# EAGLE design internal excitation 2 w gp v1.1 (EAGLE 6.5.0)
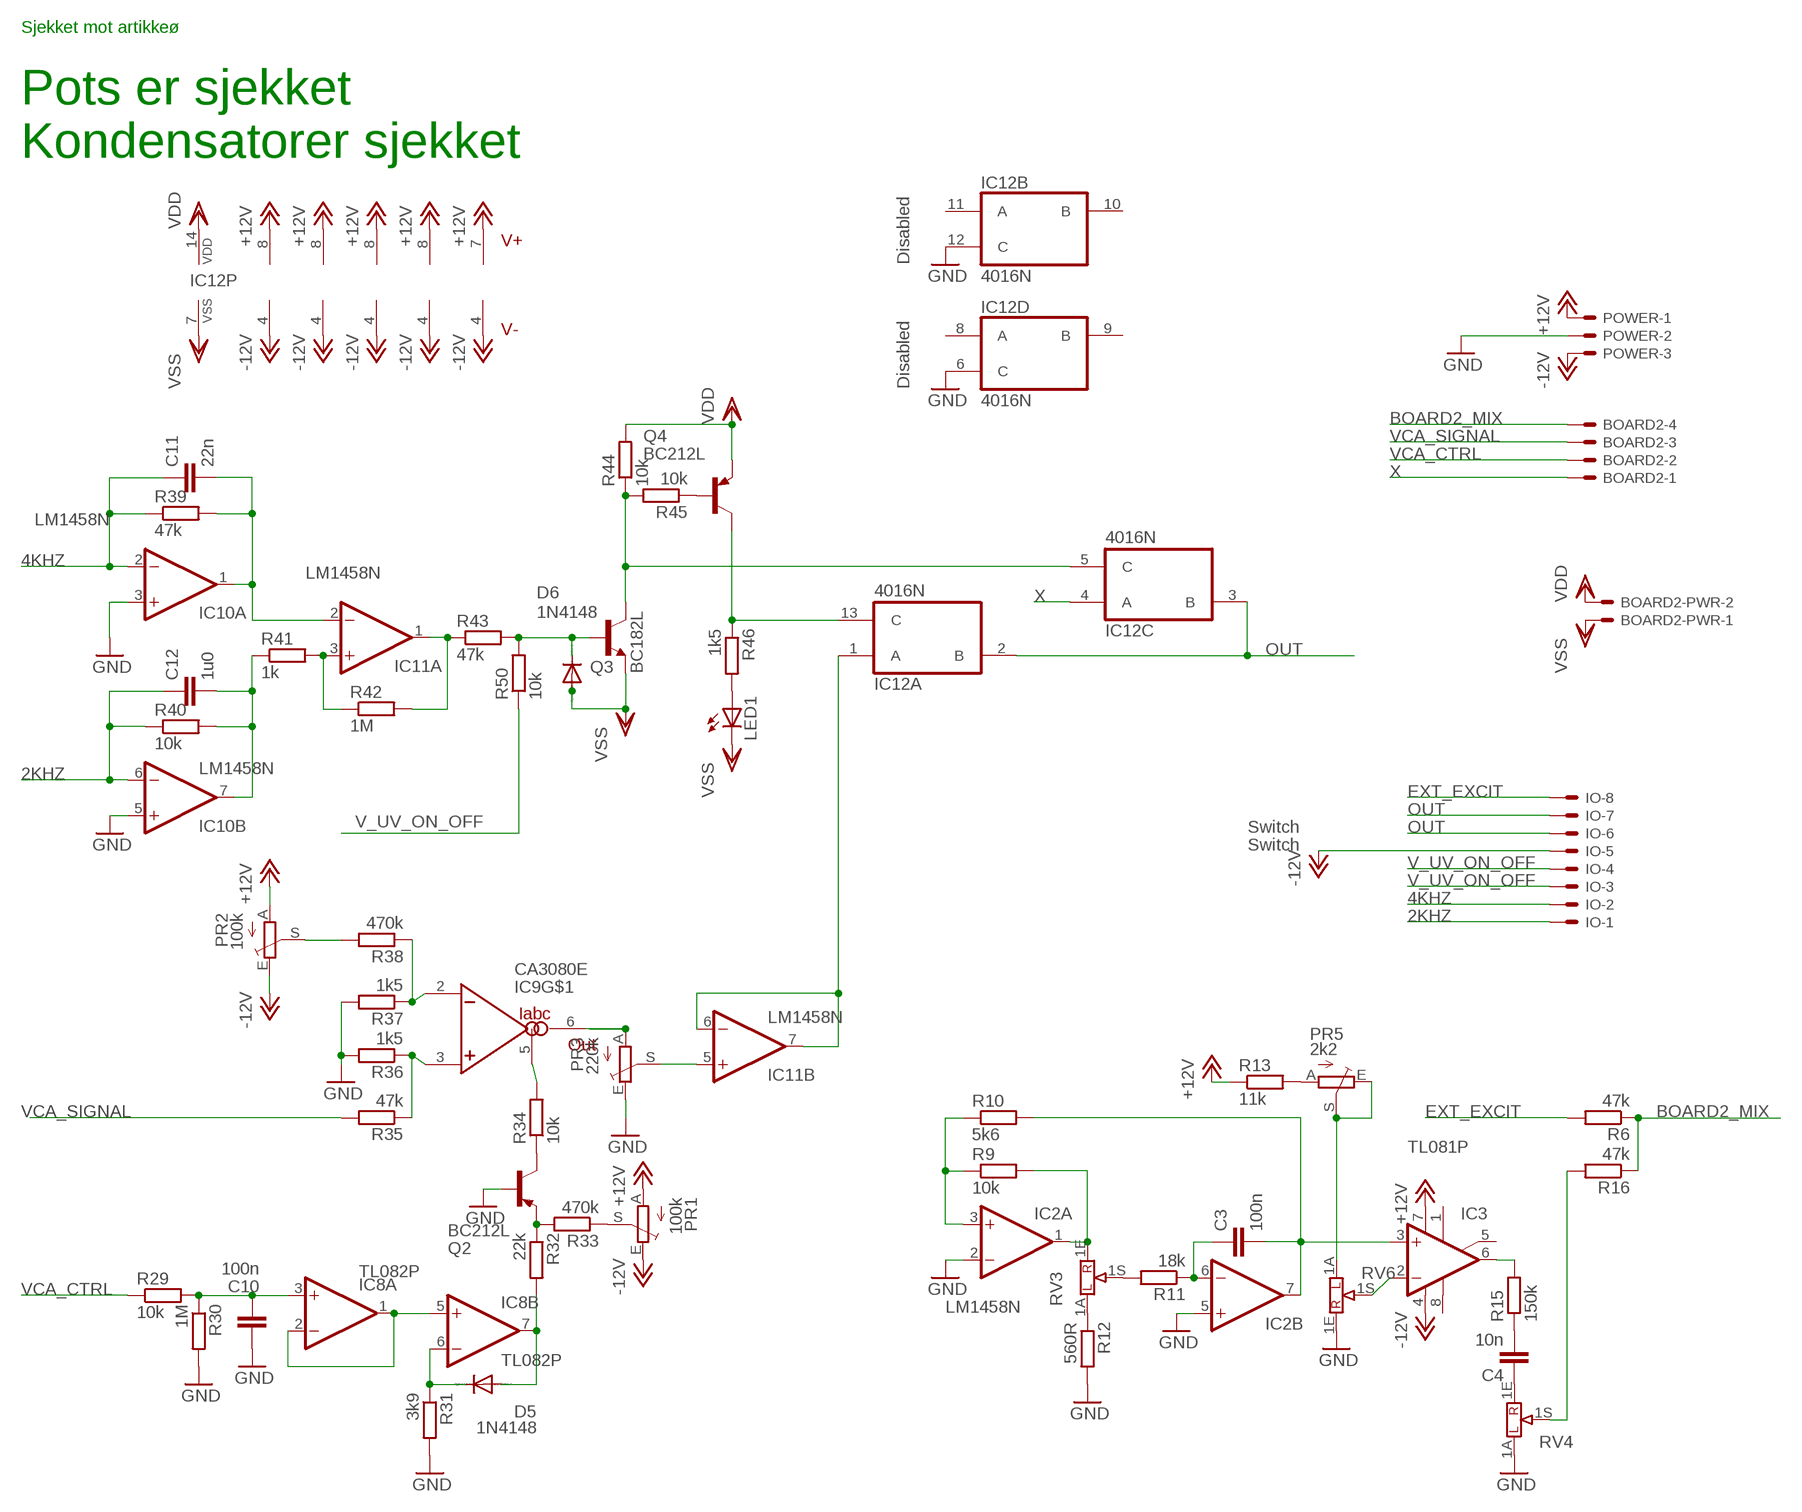
[diagram p0: schematic, sheet 1]

## Parts
BOARD2  22-23-2041  [22-23-2041]
BOARD2-PWR  22-23-2021  [22-23-2021]
C3  100n  C-EU050-030X075  [C050-030X075]
C4  10n  C-EU025-025X050  [C025-025X050]
C10  100n  C-EU050-030X075  [C050-030X075]
C11  22n  C-EU050-030X075  [C050-030X075]
C12  1u0  C-EU050-030X075  [C050-030X075]
D5  1N4148  1N4148DOJ35-5  [DO35-5J]
D6  1N4148  1N4148DOJ35-5  [DO35-5J]
IC2  LM1458N  [DIL08]
IC3  TL081P  [DIL08]
IC8  TL082P  [DIL08]
IC9  CA3080E  [DIL08]
IC10  LM1458N  [DIL08]
IC11  LM1458N  [DIL08]
IC12  4016N  [DIL14]
IO  22-23-2081  [22-23-2081]
LED1  LED3MM  [LED3MM]
POWER  KK-156-3  [KK-156-3]
PR1  100k  TRIM_EU-CA9V  [CA9V]
PR2  100k  TRIM_EU-CA9V  [CA9V]
PR3  220k  TRIM_EU-CA9V  [CA9V]
PR5  2k2  TRIM_EU-CA9V  [CA9V]
Q2  BC212L  BF493S-PNP-TO92-CBE  [TO92-CBE]
Q3  BC182L  -NPN-TO92-ECB  [TO92-ECB]
Q4  BC212L  BF493S-PNP-TO92-CBE  [TO92-CBE]
R6  47k  R-EU_0207/10  [0207/10]
R9  10k  R-EU_0207/7  [0207/7]
R10  5k6  R-EU_0207/7  [0207/7]
R11  18k  R-EU_0207/7  [0207/7]
R12  560R  R-EU_0207/7  [0207/7]
R13  11k  R-EU_0207/7  [0207/7]
R15  150k  R-EU_0207/7  [0207/7]
R16  47k  R-EU_0207/7  [0207/7]
R29  10k  R-EU_0207/7  [0207/7]
R30  1M  R-EU_0207/7  [0207/7]
R31  3k9  R-EU_0207/7  [0207/7]
R32  22k  R-EU_0207/7  [0207/7]
R33  470k  R-EU_0207/7  [0207/7]
R34  10k  R-EU_0207/7  [0207/7]
R35  47k  R-EU_0207/7  [0207/7]
R36  1k5  R-EU_0207/7  [0207/7]
R37  1k5  R-EU_0207/7  [0207/7]
R38  470k  R-EU_0207/7  [0207/7]
R39  47k  R-EU_0207/7  [0207/7]
R40  10k  R-EU_0207/7  [0207/7]
R41  1k  R-EU_0207/7  [0207/7]
R42  1M  R-EU_0207/7  [0207/7]
R43  47k  R-EU_0207/7  [0207/7]
R44  10k  R-EU_0207/7  [0207/7]
R45  10k  R-EU_0207/7  [0207/7]
R46  1k5  R-EU_0207/7  [0207/7]
R50  10k  R-EU_0207/7  [0207/7]
RV3  10k log  POT16_W_BRACKET""  [POT16_W_BRACKET]
RV4  10k log  POT16_W_BRACKET""  [POT16_W_BRACKET]
RV6  10k  POT16_W_BRACKET""  [POT16_W_BRACKET]

## Nets
2KHZ: C12.1 IC10.6(B:-IN) IO.1 R40.1
4KHZ: C11.1 IC10.2(A:-IN) IO.2 R39.1
+12V: IC2.8(P:V+) IC3.7(V+) IC8.8(P:V+) IC9.7(V+) IC10.8(P:V+) IC11.8(P:V+) POWER.1 PR1.A PR2.A R13.1
-12V: IC2.4(P:V-) IC3.4(V-) IC8.4(P:V-) IC9.4(V-) IC10.4(P:V-) IC11.4(P:V-) IO.5 POWER.3 PR1.E PR2.E
BOARD2_MIX: BOARD2.4 R6.1 R16.1
EXT_EXCIT: IO.8 R6.2
GND: C10.1 IC2.2(A:-IN) IC2.5(B:+IN) IC10.3(A:+IN) IC10.5(B:+IN) IC12.6(D:C) IC12.12(B:C) POWER.2 PR3.E Q2.B R12.2 R30.2 R31.2 R36.2 R37.2 RV4.1A RV6.1E
N$1: IC2.3(A:+IN) R9.1 R10.1
N$2: IC2.1(A:OUT) R9.2 RV3.1E
N$3: R11.2 RV3.1S
N$4: C3.1 IC2.6(B:-IN) R11.1
N$5: R12.1 RV3.1A
N$6: C3.2 IC2.7(B:OUT) IC3.3(+IN) R10.2
N$7: IC3.2(-IN) RV6.1S
N$8: PR5.A R13.2
N$9: PR5.E PR5.S RV6.1A
N$10: IC3.6(OUT) R15.2
N$11: C4.2 R15.1
N$12: C4.1 RV4.1E
N$13: R16.2 RV4.1S
N$14: IC11.3(A:+IN) R41.2 R42.1
N$15: C11.2 IC10.1(A:OUT) IC11.2(A:-IN) R39.2
N$16: IC11.1(A:OUT) R42.2 R43.1
N$17: C12.2 IC10.7(B:OUT) R40.2 R41.1
N$18: LED1.A R46.2
N$19: IC12.5(C:C) Q3.C R44.1 R45.2
N$20: Q4.B R45.1
N$21: D6.C Q3.B R43.2 R50.2
N$22: IC9.6(OUT) PR3.A
N$23: IC12.13(A:C) Q4.C R46.1
N$24: Q2.C R34.1
N$25: IC9.3(+IN) R35.1 R36.1
N$26: IC9.2(-IN) R37.1 R38.1
N$27: PR2.S R38.2
N$28: IC9.5(IABC) R34.2
N$30: Q2.E R32.1 R33.2
N$31: PR1.S R33.1
N$34: IC11.5(B:+IN) PR3.S
N$35: IC11.6(B:-IN) IC11.7(B:OUT) IC12.1(A:A)
N$37: D5.A IC8.7(B:OUT) R32.2
N$38: IC8.1(A:OUT) IC8.2(A:-IN) IC8.5(B:+IN)
N$41: D5.C IC8.6(B:-IN) R31.1
N$42: C10.2 IC8.3(A:+IN) R29.2 R30.1
OUT: IC12.2(A:B) IC12.3(C:B) IO.6 IO.7
V_UV_ON_OFF: IO.3 IO.4 R50.1
VCA_CTRL: BOARD2.2 R29.1
VCA_SIGNAL: BOARD2.3 R35.2
VDD: BOARD2-PWR.2 IC12.14(P:VDD) Q4.E R44.2
VSS: BOARD2-PWR.1 D6.A IC12.7(P:VSS) LED1.K(C) Q3.E
X: BOARD2.1 IC12.4(C:A)
Unconnected: IC3.1(ON1) IC3.5(ON2) IC3.8(OPT) IC12.8(D:A) IC12.9(D:B) IC12.10(B:B) IC12.11(B:A) RV3.M1 RV3.M2 RV3.M3 RV3.M4 RV4.M1 RV4.M2 RV4.M3 RV4.M4 RV6.M1 RV6.M2 RV6.M3 RV6.M4

## Notes on the sheet
- Sjekket mot artikkeø
- Pots er sjekket
- Kondensatorer sjekket
- Disabled
- Disabled
- Switch
- Switch

## Library data of the parts
BOARD2 = con-molex:22-23-2041: .100" (2.54mm) Center Header - 4 Pin; MF: MOLEX; MPN: 22-23-2041; OC_FARNELL: 1462920; OC_NEWARK: 38C0355
BOARD2-PWR = con-molex:22-23-2021: .100" (2.54mm) Center Header - 2 Pin; MF: MOLEX; MPN: 22-23-2021; OC_FARNELL: 1462926; OC_NEWARK: 25C3832
C3 C4 C10-C12 = resistor:C-EU: CAPACITOR, European symbol
D5 D6 = joakim:1N4148: DIODE high speed (Philips)
IC2 IC10 IC11 = linear:*1458: OP AMP
IC3 = linear:TL081: OP AMP
IC8 = linear:TL082: OP AMP
IC9 = joakim:CA3080: Original RCA OTA.
IC12 = 40xx:4016: Quad bilateral ANALOG SWITCH
IO = con-molex:22-23-2081: .100" (2.54mm) Center Header - 8 Pin; MF: MOLEX; MPN: 22-23-2081; OC_FARNELL: 1756826; OC_NEWARK: 01C7592
LED1 = led:LED: LED OSRAM: - CHIPLED LG R971, LG N971, LY N971, LG Q971, LY Q971, LO R971, LY R971 LH N974, LH R974 LS Q976, LO Q976, LY Q976 LO Q996 - Hyper CHIPLED LW Q18S LB Q993, LB Q99A, LB R99A - SideLED LS A670, LO A670, LY A670, LG A670, LP A670 LB A673, LV A673, LT A673, LW A673 LH A674 LY A675 LS A676, LA A676, LO A676, LY A676, LW A676 LS A679, LY A679, LG A679 - Hyper Micro SIDELED® LS Y876, LA Y876, LO Y876, LY Y876 LT Y87S - SmartLED LW L88C, LW L88S LB L89C, LB L89S, LG L890 LS L89K, LO L89K, LY L89K LS L896, LA L896, LO L896, LY L896 - TOPLED LS T670, LO T670, LY T670, LG T670, LP T670 LSG T670, LSP T670, LSY T670, LOP T670, LYG T670 LG T671, LOG T671, LSG T671 LB T673, LV T673, LT T673, LW T673 LH T674 LS T676, LA T676, LO T676, LY T676, LB T676, LH T676, LSB T676, LW T676 LB T67C, LV T67C, LT T67C, LS T67K, LO T67K, LY T67K, LW E67C LS E67B, LA E67B, LO E67B, LY E67B, LB E67C, LV E67C, LT E67C LW T67C LS T679, LY T679, LG T679 LS T770, LO T770, LY T770, LG T770, LP T770 LB T773, LV T773, LT T773, LW T773 LH T774 LS E675, LA E675, LY E675, LS T675 LS T776, LA T776, LO T776, LY T776, LB T776 LHGB T686 LT T68C, LB T68C - Hyper Mini TOPLED® LB M676 - Mini TOPLED Santana® LG M470 LS M47K, LO M47K, LY M47K Source: http://www.osram.convergy.de LUXEON: - LUMILED® LXK2-PW12-R00, LXK2-PW12-S00, LXK2-PW14-U00, LXK2-PW14-V00 LXK2-PM12-R00, LXK2-PM12-S00, LXK2-PM14-U00 LXK2-PE12-Q00, LXK2-PE12-R00, LXK2-PE12-S00, LXK2-PE14-T00, LXK2-PE14-U00 LXK2-PB12-K00, LXK2-PB12-L00, LXK2-PB12-M00, LXK2-PB14-N00, LXK2-PB14-P00, LXK2-PB14-Q00 LXK2-PR12-L00, LXK2-PR12-M00, LXK2-PR14-Q00, LXK2-PR14-R00 LXK2-PD12-Q00, LXK2-PD12-R00, LXK2-PD12-S00 LXK2-PH12-R00, LXK2-PH12-S00 LXK2-PL12-P00, LXK2-PL12-Q00, LXK2-PL12-R00 Source: www.luxeon.com KINGBRIGHT: KA-3528ASYC Source: www.kingbright.com
POWER = con-molex:KK-156-3: KK 156 HEADER Source: http://www.molex.com/pdm_docs/sd/026604100_sd.pdf; OC_FARNELL: unknown; OC_NEWARK: unknown
PR1-PR3 PR5 = pot:TRIM_EU-: POTENTIOMETER
Q2 Q4 = transistor:*-PNP-: PNP Transistror
Q3 = transistor:*-NPN-: NPN Transistror BF959 corrected 2008.03.06
R6 R9-R13 R15 R16 R29-R46 R50 = resistor:R-EU_: RESISTOR, European symbol
RV3 RV4 RV6 = joakim:POT16_W_BRACKET: POTENTIOMETER potentiometer, 16 mm w 5mm pitch and OMEG bracket, 17,8 x 7,5 mm

## Board
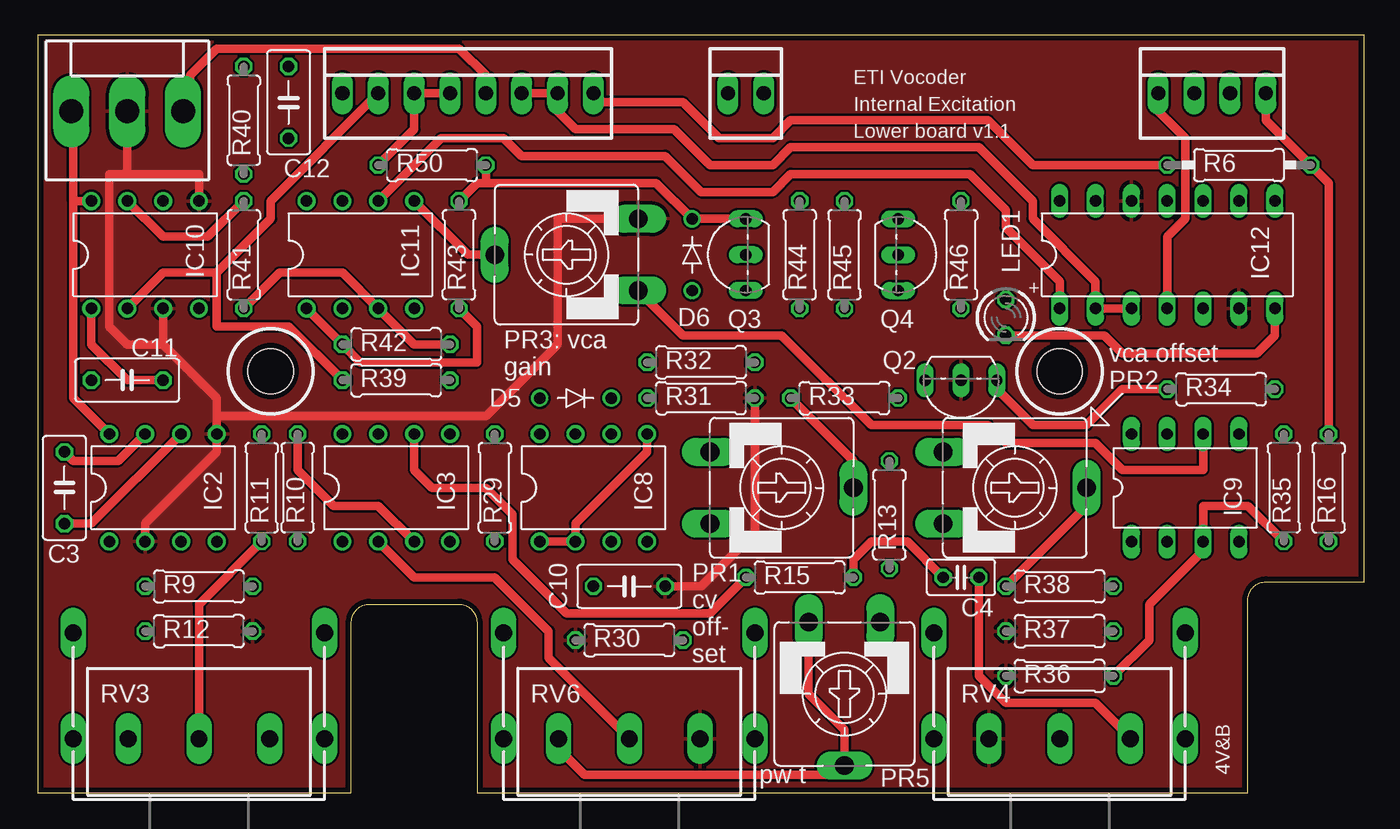
[diagram p1: board, top side]
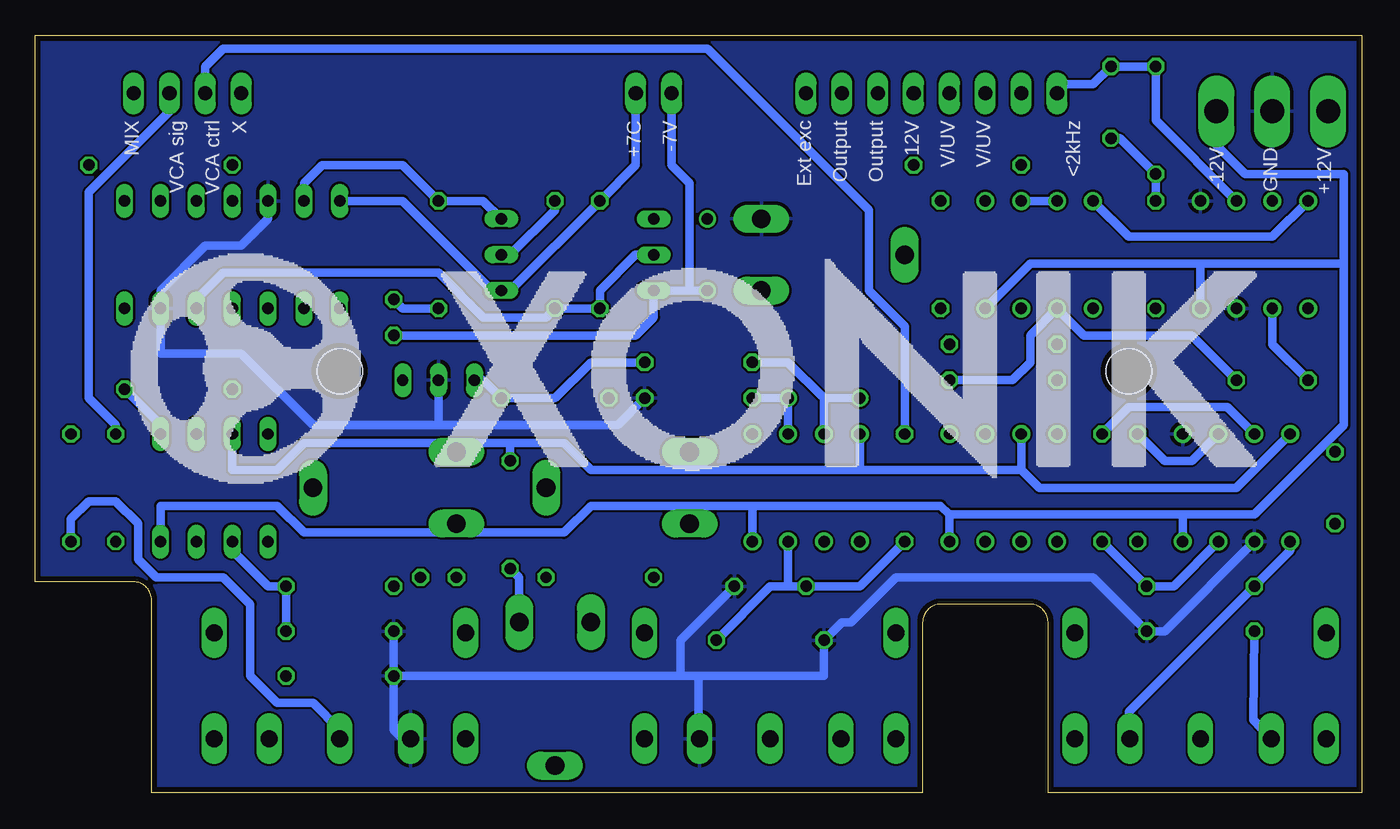
[diagram p2: board, bottom side, seen from below]

Size 93.96 x 53.65 mm. Coordinates in mm from the lower left corner, seen from the top.
Outline: 0,0 22.23,0 22.23,12.06 arc-90 23.5,13.34 29.84,13.34 arc-90 31.11,12.06 31.11,0 85.72,0 85.72,13.65 arc-90 87,14.92 93.96,14.92 93.96,53.65 0,53.65 0,0
Copper layers (1*16): Top 0.0356mm / dielectric 1.5011mm / Bottom 0.0356mm
Design rules "default": minimum track width 6mil, minimum drill 13mil, track to track 6mil, track to pad 6mil, pad to pad 6mil, via to via 6mil, smd to smd 6mil, copper to edge 15mil, drill to drill 6mil, minimum pad ring 7mil, minimum via ring 7mil, stop-mask expansion 3mil, vias tented up to drill 0mil, thermal gap 10mil
Holes 3.2 mm at 16.51,29.84 72.39,29.84

### Footprints (pad centres in the part's own frame; a part is rotated, then mirrored left to right if it is on the bottom)
22-23-2041 = drill 1 long: 1 -3.81,0; 2 -1.27,0; 3 1.27,0; 4 3.81,0
22-23-2021 = drill 1 long: 1 -1.27,0; 2 1.27,0
C050-030X075 = drill 0.813 octagon: 1 -2.54,0; 2 2.54,0
C025-025X050 = drill 0.813 octagon: 1 -1.27,0; 2 1.27,0
DO35-5J = drill 0.813: A 2.54,0; C -2.54,0
DIL08 = drill 0.813 pad 1.27: 1 -3.81,-3.81; 2 -1.27,-3.81; 3 1.27,-3.81; 4 3.81,-3.81; 5 3.81,3.81; 6 1.27,3.81; 7 -1.27,3.81; 8 -3.81,3.81
DIL08' = drill 0.813 long: 1 -3.81,-3.81; 2 -1.27,-3.81; 3 1.27,-3.81; 4 3.81,-3.81; 5 3.81,3.81; 6 1.27,3.81; 7 -1.27,3.81; 8 -3.81,3.81
DIL14 = drill 0.813 long: 1 -7.62,-3.81; 2 -5.08,-3.81; 3 -2.54,-3.81; 4 0,-3.81; 5 2.54,-3.81; 6 5.08,-3.81; 7 7.62,-3.81; 8 7.62,3.81; 9 5.08,3.81; 10 2.54,3.81; 11 0,3.81; 12 -2.54,3.81; 13 -5.08,3.81; 14 -7.62,3.81
22-23-2081 = drill 1 long: 1 -8.89,0; 2 -6.35,0; 3 -3.81,0; 4 -1.27,0; 5 1.27,0; 6 3.81,0; 7 6.35,0; 8 8.89,0
LED3MM = drill 0.813 octagon: A -1.27,0; K 1.27,0
KK-156-3 = drill 1.7 pad 2.184 long: 1 -3.96,0; 2 0,0; 3 3.96,0
CA9V = drill 1.321 long: A -2.54,-5.08; E 2.54,-5.08; S 0,5.08
TO92-CBE = drill 0.813 long: B 0,0; C -2.54,0; E 2.54,0
TO92-ECB = drill 0.813 long: B 2.54,0; C 0,0; E -2.54,0
0207/10 = drill 0.813 octagon: 1 -5.08,0; 2 5.08,0
0207/7 = drill 0.813 octagon: 1 -3.81,0; 2 3.81,0
POT16_W_BRACKET = drill 1.2 long: 1A -5,0; 1E 5,0; 1S 0,0; M1 -8.9,0; M2 8.9,0; M3 8.9,7.5; M4 -8.9,7.5

### Placement (x,y rotation side)
BOARD2  83.19,49.53 0 top
BOARD2-PWR  50.16,49.53 0 top
C3  1.91,21.59 90 top
C4  65.41,15.24 180 top
C10  41.91,14.61 180 top
C11  6.35,29.21 0 top
C12  17.78,48.9 270 top
D5  38.1,27.94 180 top
D6  46.35,38.1 270 top
IC2  8.89,21.59 0 top
IC3  25.4,21.59 0 top
IC8  39.37,21.59 0 top
IC9  CA3080E  [DIL08']  81.28,21.59 0 top
IC10  7.62,38.1 0 top
IC11  22.86,38.1 0 top
IC12  80.01,38.1 0 top
IO  30.48,49.53 0 top
LED1  68.58,33.66 270 top
POWER  6.35,48.26 0 top
PR1  52.7,21.59 270 top
PR2  69.22,21.59 270 top
PR3  37.47,38.1 90 top
PR5  57.15,6.99 180 top
Q2  65.41,29.21 180 top
Q3  50.16,38.1 90 top
Q4  60.96,38.1 270 top
R6  85.09,44.45 180 top
R9  11.43,14.61 180 top
R10  18.41,21.59 90 top
R11  15.88,21.59 270 top
R12  11.43,11.43 0 top
R13  60.33,19.68 270 top
R15  53.98,15.24 180 top
R16  91.44,21.59 270 top
R29  32.38,21.59 270 top
R30  41.91,10.79 180 top
R31  46.99,27.94 0 top
R32  46.99,30.48 180 top
R33  57.15,27.94 0 top
R34  83.82,28.57 0 top
R35  88.27,21.59 90 top
R36  72.39,8.26 180 top
R37  72.39,11.43 180 top
R38  72.39,14.61 180 top
R39  25.4,29.21 0 top
R40  14.61,47.62 270 top
R41  14.61,38.1 270 top
R42  25.4,31.75 180 top
R43  29.84,38.1 90 top
R44  53.98,38.1 90 top
R45  57.15,38.1 270 top
R46  65.41,38.1 270 top
R50  27.94,44.45 0 top
RV3  11.43,3.81 0 top
RV4  72.39,3.81 0 top
RV6  41.91,3.81 0 top

### Tracks (layer width: path | path; a pad name or v marks a point on that pad's centre or on a via)
2KHZ
  Bottom 0.61: IO.1 20.95,50.16 19.05,50.16 C12.1 R40.1 14.61,47.62 IC10.6
4KHZ
  Top 0.61: IC10.2 8.89,36.83 12.7,36.83 | 12.7,36.83 16.51,40.64 16.51,41.91 IO.2 | R39.1 17.78,33.02 12.7,33.02 12.7,36.83
  Bottom 0.61: IC10.2 6.35,31.75 C11.1
+12V
  Top 0.61: 2.54,41.91 2.54,27.94 IC2.8 | IC10.8 2.54,41.91 | 2.54,41.91 2.54,49.38 POWER.1
  Bottom 0.61: IC2.8 8.89,21.59 22.86,21.59 24.13,22.86 | 24.13,22.86 35.56,22.86 | IC3.7 24.13,22.86 | IC8.8 35.56,22.86 | 35.56,22.86 47.62,22.86 | PR1.A 47.62,22.86 | 47.62,22.86 54.61,22.86 56.52,24.77 60.33,24.77 | 60.33,24.77 63.5,24.77 PR2.A 64.77,24.77 74.93,24.77 76.83,22.86 80.01,22.86 IC9.7 | IC11.8 16.51,39.37 6.35,39.37 IC10.8 | R13.1 60.33,24.77
-12V
  Top 0.61: IO.5 31.75,50.8 29.84,52.7 12.7,52.7 10.79,50.8 10.79,48.74 POWER.3
  Bottom 0.61: IC2.4 12.7,19.68 | 12.7,19.68 29.21,19.68 | 29.21,19.68 29.84,20.32 43.18,20.32 | IC3.4 29.21,19.68 | 43.18,20.32 47.62,20.32 | 47.62,20.32 54.61,20.32 56.52,18.41 63.5,18.41 PR2.E 64.77,18.41 74.93,18.41 76.83,20.32 85.09,20.32 IC9.4 | PR1.E 47.62,20.32 | IC8.4 43.18,20.32 | 11.43,37.47 23.5,37.47 IC11.4 | 11.43,37.47 IC10.4 | 11.43,37.47 1.27,37.47 | 1.27,37.47 1.27,26.04 7.62,19.68 12.7,19.68 | POWER.3 10.31,45.87 8.26,43.81 1.27,43.81 1.27,37.47
BOARD2_MIX
  Top 0.61: R16.1 91.44,43.18 R6.1 87,47.62 BOARD2.4
EXT_EXCIT
  Top 0.61: R6.2 70.48,44.45 67.31,47.62 53.34,47.62 52.07,46.35 48.26,46.35 45.72,48.9 40.01,48.9 IO.8
GND
  Top 0.61: IC2.2 7.62,19.05 12.7,24.13 IC2.5 12.7,26.67 | C10.1 46.99,14.61 50.8,18.41 R31.2 | IC10.5 11.43,43.81 6.35,43.81 | 8.89,31.75 12.7,27.94 12.7,26.67 | IC10.3 8.89,31.75 | 8.89,31.75 6.35,31.75 5.08,33.02 5.08,43.81 6.35,43.81 | 6.35,43.81 POWER.2 | PR3.E 36.83,40.64 36.83,31.75 31.75,26.67 12.7,26.67
  Bottom 0.61: IC2.2 13.97,11.43 R12.2 19.05,15.24 33.02,15.24 36.2,12.06 36.83,12.06 R30.2 38.1,8.26 46.99,8.26 | RV6.1E 46.99,3.89 46.99,8.26 | 46.99,8.26 48.26,8.26 | 48.26,8.26 48.26,10.79 C10.1 | 48.26,8.26 R36.2 | 67.31,3.81 RV4.1A 67.94,3.81 68.58,4.45 R36.2 | R36.2 R37.2 | IC12.12 77.47,40.64 79.38,38.73 81.92,38.73 85.09,35.56 IC12.6 85.09,31.11 79.38,31.11 74.3,26.04 65.41,26.04 | 65.41,26.04 52.7,26.04 R31.2 | Q2.B 65.41,26.04
  pour Bottom: -0.76,54.61 -0.76,-0.51 94.61,-0.51 94.61,54.61
  pour Top: 0,53.98 0,0 94.36,0 94.36,53.98
N$1
  Bottom 0.61: R10.1 R9.1 13.34,14.61 IC2.3
N$2
  Bottom 0.61: IC2.1 5.08,17.14 R9.2 16.51,5.71 16.51,3.81 RV3.1E
N$3
  Top 0.61: R11.2 11.43,13.34 RV3.1S
N$4
  Top 0.61: C3.1 3.81,19.05 IC2.6
  Bottom 0.61: IC2.6 12.06,23.5 13.97,23.5 R11.1
N$5
  Bottom 0.61: RV3.1A 7.7,5.16 R12.1
N$6
  Top 0.61: R10.2 18.41,22.86 20.95,20.32 24.13,20.32 IC3.3 | C3.2 2.54,23.5 5.71,23.5 IC2.7
  Bottom 0.61: IC2.7 9.53,27.3 16.51,27.3 R10.2
N$7
  Top 0.61: IC3.2 26.67,15.24 32.38,15.24 36.2,11.43 36.2,9.53 RV6.1S
N$8
  Bottom 0.61: PR5.A 59.69,15.24 R13.2
N$9
  Top 0.61: PR5.E 54.61,6.99 57.15,4.45 PR5.S 56.52,1.27 38.73,1.27 36.91,3.1 RV6.1A
N$10
  Top 0.61: IC3.6 26.67,22.86 27.94,21.59 31.75,21.59 33.66,19.68 33.66,16.51 37.47,12.7 47.62,12.7 R15.2
N$11
  Top 0.61: R15.1 57.78,16.51 59.05,17.78 61.59,17.78 C4.2
N$12
  Top 0.61: RV4.1E 77.39,3.89 74.93,6.35 68.58,6.35 66.67,8.26 C4.1
N$13
  Bottom 0.61: RV4.1S 72.39,4.45 74.3,6.35 76.83,6.35 78.74,8.26 78.74,13.34 80.64,15.24 85.41,15.24 86.68,16.51 86.68,19.05 88.27,20.64 90.17,20.64 91.44,19.37 R16.2
N$14
  Top 0.61: R41.2 17.14,36.83 21.59,36.83 IC11.3 26.67,31.75 R42.1
N$15
  Top 0.61: IC10.1 3.81,31.75 6.35,29.21 C11.2
  Bottom 0.61: R39.2 24.77,29.21 23.5,30.48 23.5,32.38 IC11.2 19.68,32.38 12.06,32.38 C11.2
N$16
  Top 0.61: IC11.1 R42.2 22.86,30.48 31.11,30.48 31.11,33.02 R43.1
N$17
  Top 0.61: IC10.7 8.89,39.37 12.06,39.37 R41.1
  Bottom 0.61: R41.1 R40.2 17.14,46.35 C12.2
N$18
  Bottom 0.61: R46.2 67.94,34.29 LED1.A
N$19
  Bottom 0.61: Q3.C 51.44,38.1 53.98,35.56 R44.1 R45.2 57.78,33.66 62.23,33.66 65.41,36.83 80.64,36.83 82.55,34.92 IC12.5
N$20
  Bottom 0.61: R45.1 57.15,41.27 60.33,38.1 Q4.B
N$21
  Top 0.61: 31.75,43.18 43.81,43.18 D6.C Q3.B | 31.75,43.18 31.11,43.18 R43.2 | R50.2 31.75,43.18
N$22
  Top 0.61: PR3.A 45.72,32.38 52.7,32.38 59.05,26.04 67.31,26.04 68.58,24.77 74.93,24.77 76.83,22.86 82.55,22.86 IC9.6
N$23
  Bottom 0.61: Q4.C 62.23,41.91 R46.1 67.94,44.45 73.66,44.45 74.93,43.18 IC12.13
N$24
  Top 0.61: Q2.C 67.94,28.57 70.48,26.04 74.3,26.04 76.83,28.57 R34.1
N$25
  Top 0.61: R36.1 78.74,10.79 78.74,13.34 82.55,17.14 IC9.3 82.55,20.32 85.72,20.32 R35.1
N$26
  Bottom 0.61: R37.1 R38.1 77.47,14.61 80.01,17.14 IC9.2
N$27
  Top 0.61: R38.2 74.3,20.32 PR2.S
N$28
  Bottom 0.61: IC9.5 85.09,26.04 R34.2
N$30
  Bottom 0.61: R32.1 54.61,30.48 57.15,27.94 R33.2 62.23,29.21 Q2.E
N$31
  Top 0.61: PR1.S 57.78,23.5 R33.1
N$34
  Top 0.61: PR3.S 30.48,38.1 IC11.5
N$35
  Top 0.61: IC11.6 28.57,46.35 33.02,46.35 34.29,45.09 44.45,45.09 46.99,42.55 52.07,42.55 53.34,43.81 66.04,43.81 68.58,41.27 68.58,40.01 72.39,36.2 IC12.1
  Bottom 0.61: IC11.7 IC11.6
N$37
  Bottom 0.61: 38.1,27.94 IC8.7 | D5.A 38.1,27.94 | 38.1,27.94 40.64,30.48 R32.2
N$38
  Top 0.61: IC8.1 IC8.2 38.1,19.05 43.18,24.13 IC8.5
N$41
  Bottom 0.61: IC8.6 D5.C R31.1
N$42
  Bottom 0.61: IC8.3 40.64,14.61 | R30.1 41.91,14.61 40.64,14.61 | 40.64,14.61 C10.2 35.56,14.61 R29.2
OUT
  Top 0.61: IO.6 IO.7 36.83,48.26 38.1,46.99 45.09,46.99 47.62,44.45 52.07,44.45 53.34,45.72 66.67,45.72 70.48,41.91 70.48,40.64 74.93,36.2 IC12.2 IC12.3
V_UV_ON_OFF
  Top 0.61: R50.1 26.67,46.99 IO.3 IO.4
VCA_CTRL
  Bottom 0.61: R29.1 32.38,33.02 34.92,35.56 34.92,41.27 46.35,52.7 80.64,52.7 81.92,51.44 BOARD2.2
VCA_SIGNAL
  Bottom 0.61: R35.2 88.27,26.04 90.17,27.94 90.17,42.55 84.45,48.26 BOARD2.3
VDD
  Bottom 0.61: IC12.14 67.94,41.91 61.59,35.56 Q4.E 60.33,35.56 R44.2 51.44,44.45 BOARD2-PWR.2
VSS
  Top 0.61: LED1.K 75.56,32.38 76.83,31.11 86.36,31.11 87.63,32.38 IC12.7
  Bottom 0.61: D6.A 47.62,35.56 | LED1.K 51.44,32.38 50.16,33.66 Q3.E 47.62,35.56 | 47.62,35.56 47.62,43.18 48.9,44.45 BOARD2-PWR.1
X
  Top 0.61: IC12.4 80.01,39.37 81.28,40.64 81.28,46.35 79.38,48.26 BOARD2.1

### Text on the board
tNames: ETI Vocoder | Internal Excitation | Lower board v1.1 | + | PR3: vca / gain | vca offset / PR2 | PR1 / cv / off- / set | pw t | 4V&B
bNames: <2kHz | V/UV | V/UV | 12V | Output | Output | Ext exc | -7V | +7C | X | VCA ctrl | VCA sig | MIX | +12V | GND | -12V